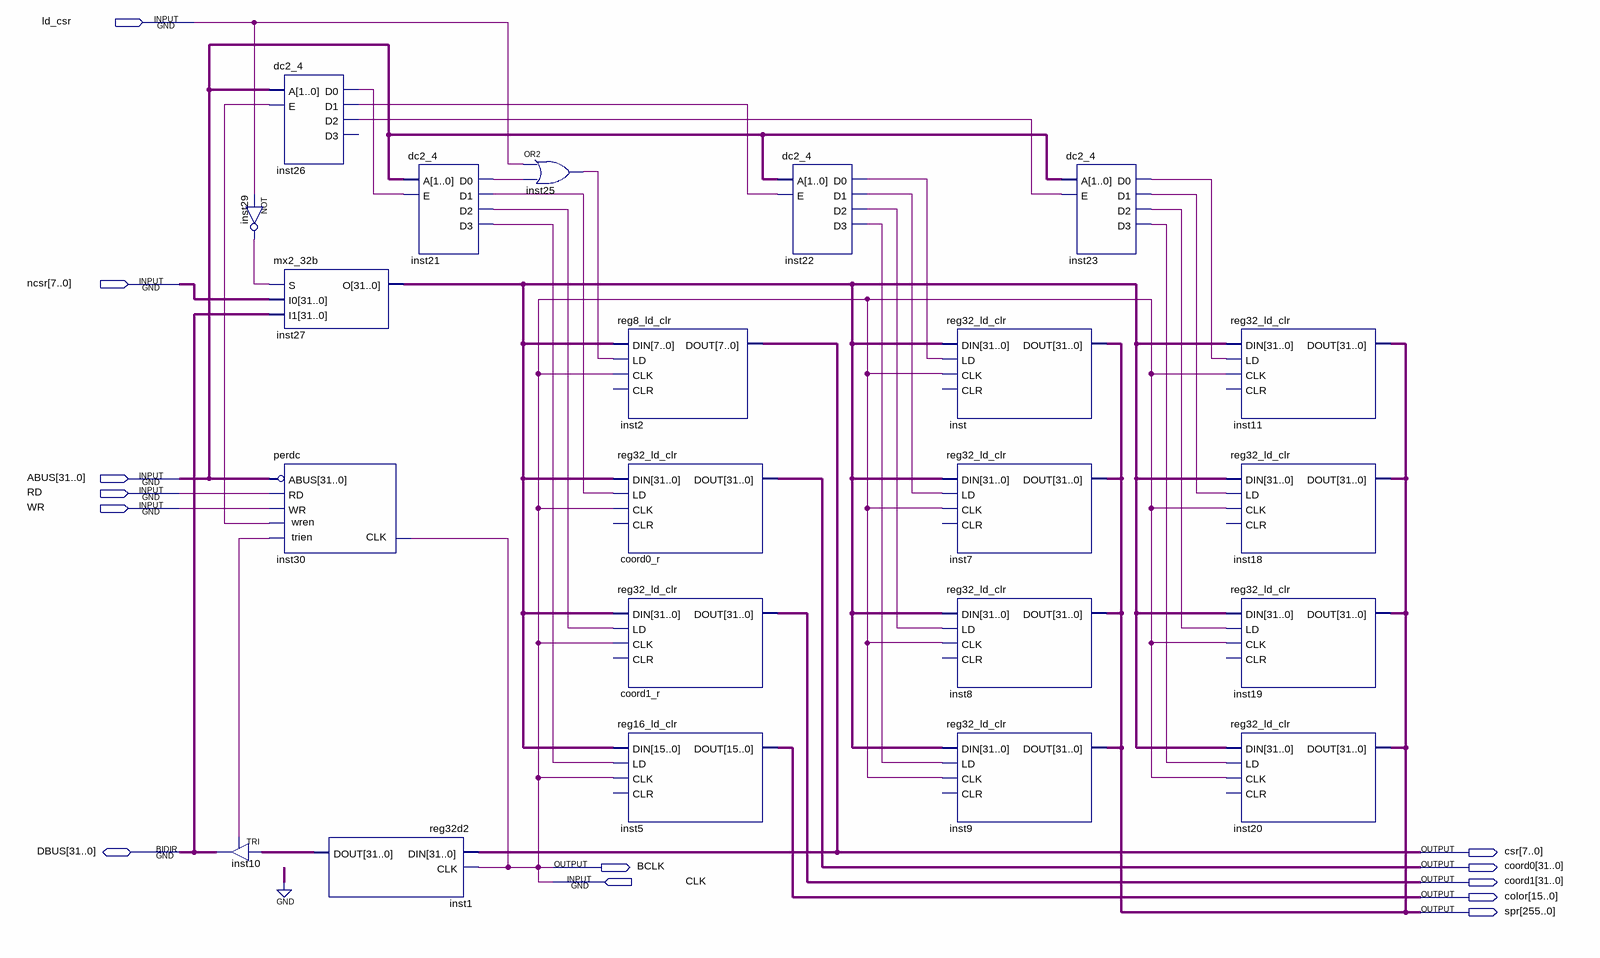
[diagram p0: schematic sheet]
// Quartus schematic bif.bdf as structural Verilog: 22 symbols, 13 pins
module bif (
  input  ld_csr,
  input  [7:0] ncsr,
  input  [31:0] ABUS,
  input  RD,
  input  WR,
  input  CLK,
  inout  [31:0] DBUS,
  output [7:0] csr,
  output BCLK,
  output [31:0] coord0,
  output [31:0] coord1,
  output [15:0] color,
  output [255:0] spr
);

  wire inst21_d0, inst21_d1, inst21_d2, inst21_d3, inst22_d0, inst22_d1, inst22_d2, inst22_d3, inst23_d0,
       inst23_d1, inst23_d2, inst23_d3, inst25_out, inst26_d0, inst26_d1, inst26_d2, inst29_out,
       inst30_trien, inst30_wren;
  wire [31:0] din, inst1_dout;

  not inst29 (inst29_out, ld_csr);
  TRI inst10[31:0] (.IN(inst1_dout), .OE(inst30_trien), .OUT(DBUS));
  dc2_4 inst26 (.A(ABUS[5:4]), .E(inst30_wren), .D0(inst26_d0), .D1(inst26_d1), .D2(inst26_d2));  // open: D3
  mx2_32b inst27 (.S(inst29_out), .I0({{24{1'b0}}, ncsr}), .I1(DBUS), .O(din));
  perdc inst30 (.ABUS(ABUS ^ 32'hfffe0000), .CLK(CLK), .RD(RD), .WR(WR), .trien(inst30_trien), .wren(inst30_wren));
  reg32d2 inst1 (.DIN({{24{1'b0}}, csr}), .CLK(CLK), .DOUT(inst1_dout));
  dc2_4 inst21 (.A(ABUS[3:2]), .E(inst26_d0), .D0(inst21_d0), .D1(inst21_d1), .D2(inst21_d2), .D3(inst21_d3));
  or inst25 (inst25_out, ld_csr, inst21_d0);
  reg8_ld_clr inst2 (.DIN(din[7:0]), .LD(inst25_out), .CLK(CLK), .DOUT(csr));  // open: CLR
  reg32_ld_clr coord0_r (.DIN(din), .LD(inst21_d1), .CLK(CLK), .DOUT(coord0));  // open: CLR
  reg32_ld_clr coord1_r (.DIN(din), .LD(inst21_d2), .CLK(CLK), .DOUT(coord1));  // open: CLR
  reg16_ld_clr inst5 (.DIN(din[15:0]), .LD(inst21_d3), .CLK(CLK), .DOUT(color));  // open: CLR
  dc2_4 inst22 (.A(ABUS[3:2]), .E(inst26_d1), .D0(inst22_d0), .D1(inst22_d1), .D2(inst22_d2), .D3(inst22_d3));
  reg32_ld_clr inst (.DIN(din), .LD(inst22_d0), .CLK(CLK), .DOUT(spr[31:0]));  // open: CLR
  reg32_ld_clr inst7 (.DIN(din), .LD(inst22_d1), .CLK(CLK), .DOUT(spr[63:32]));  // open: CLR
  reg32_ld_clr inst8 (.DIN(din), .LD(inst22_d2), .CLK(CLK), .DOUT(spr[95:64]));  // open: CLR
  reg32_ld_clr inst9 (.DIN(din), .LD(inst22_d3), .CLK(CLK), .DOUT(spr[127:96]));  // open: CLR
  dc2_4 inst23 (.A(ABUS[3:2]), .E(inst26_d2), .D0(inst23_d0), .D1(inst23_d1), .D2(inst23_d2), .D3(inst23_d3));
  reg32_ld_clr inst11 (.DIN(din), .LD(inst23_d0), .CLK(CLK), .DOUT(spr[159:128]));  // open: CLR
  reg32_ld_clr inst18 (.DIN(din), .LD(inst23_d1), .CLK(CLK), .DOUT(spr[191:160]));  // open: CLR
  reg32_ld_clr inst19 (.DIN(din), .LD(inst23_d2), .CLK(CLK), .DOUT(spr[223:192]));  // open: CLR
  reg32_ld_clr inst20 (.DIN(din), .LD(inst23_d3), .CLK(CLK), .DOUT(spr[255:224]));  // open: CLR

  assign BCLK = CLK;

  // Other names for the same wires on the sheet: csrout[7:0] = csr
endmodule
